# Altium schematic sheet onStep-board-uc.SchDoc
size A4
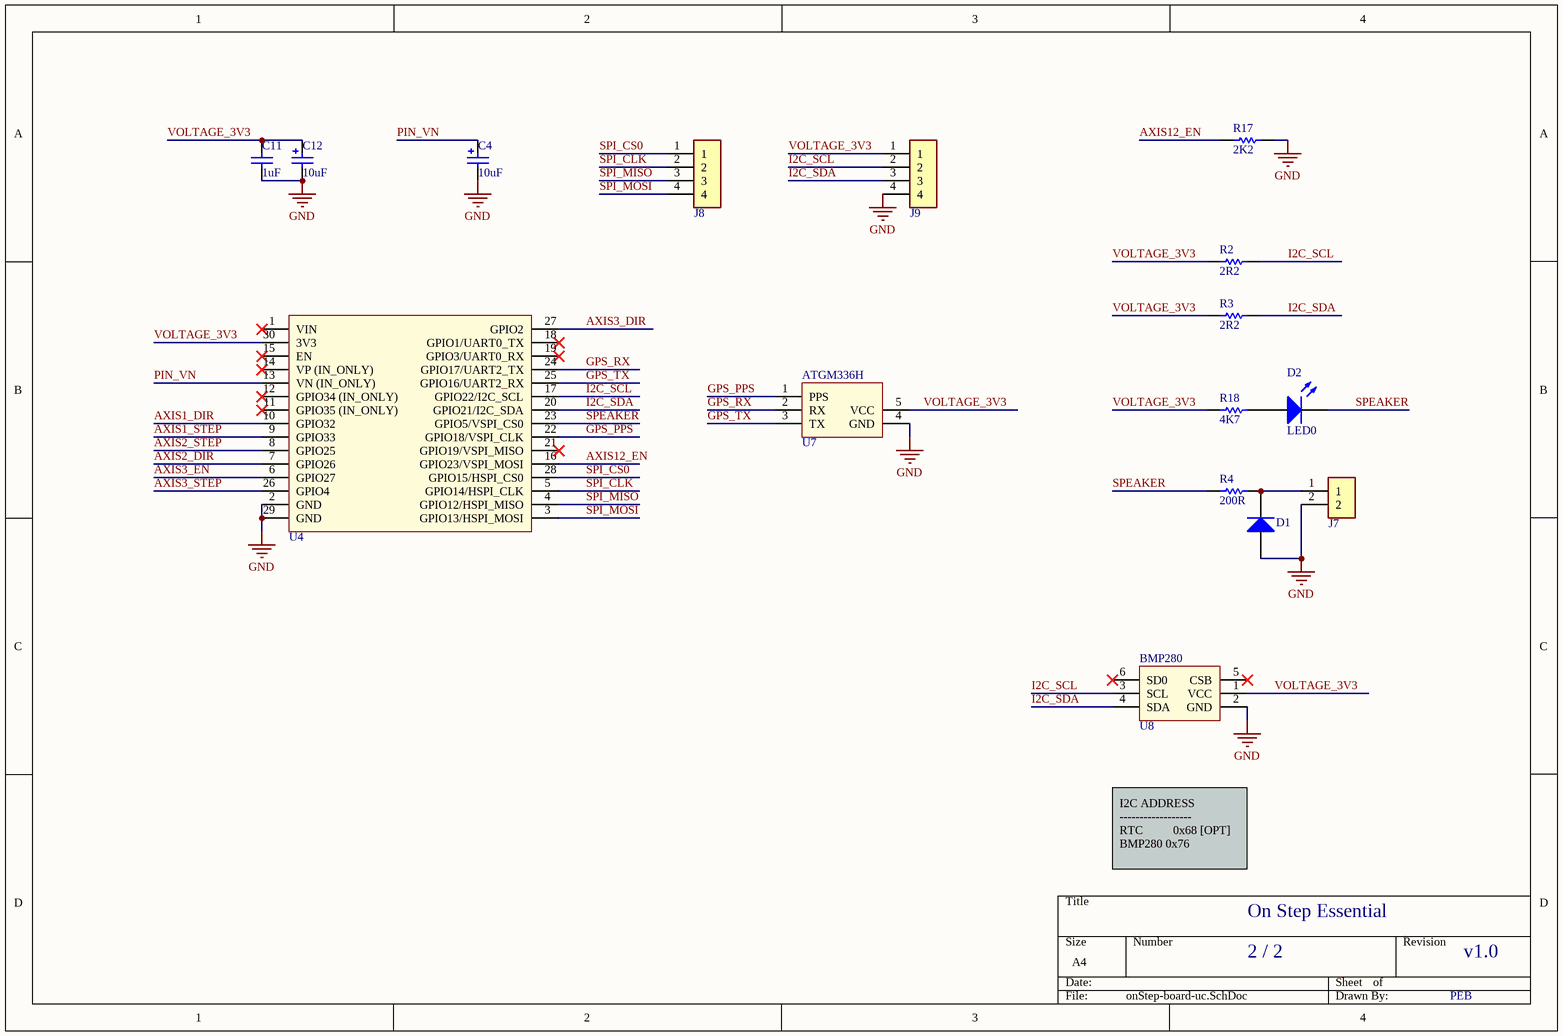
[diagram p0: onStep-board-uc.SchDoc]

## Parts
C4  value 10uF  [WCAP-ASLL_5x5.5]  (hidden comment: 865060453006)
C11  value 1uF  [0805]  (hidden comment: Cap)
C12  value 10uF  [WCAP-ASLL_5x5.5]  (hidden comment: 865060453006)
D1  Diode  [C1206]  (value not drawn)
D2  LED0  [LED-0]
J7  SPEAKER  [B2BXHALFSN]  (value not drawn)
J8  SPI  [p4]  (value not drawn)
J9  I2C  [p4]  (value not drawn)
R2  value 2R2  [0805]  (hidden comment: Res1)
R3  value 2R2  [0805]  (hidden comment: Res1)
R4  value 200R  [0805]  (hidden comment: Res1)
R17  value 2K2  [0805]  (hidden comment: Res1)
R18  value 4K7  [0805]  (hidden comment: Res1)
U4  ESP32-WROOM-DEVKIT  [ESP32-WROOM-DEVKIT]  (value not drawn)
U7  ATGM336H  [ATGM336H]
U8  BMP280  [BMP280]

## Nets
GND: C4.2(N) C11.1 C12.2(N) D1.1(A) J7.2 J9.4 R17.1 U4.2(GND) U4.29(GND) U7.4(GND) U8.2(GND)
AXIS1_DIR: U4.10(GPIO32)
AXIS1_STEP: U4.9(GPIO33)
AXIS2_DIR: U4.7(GPIO26)
AXIS2_STEP: U4.8(GPIO25)
AXIS3_DIR: U4.27(GPIO2)
AXIS3_EN: U4.6(GPIO27)
AXIS3_STEP: U4.26(GPIO4)
AXIS12_EN: R17.2 U4.16(GPIO23/VSPI_MOSI)
GPS_PPS: U4.22(GPIO18/VSPI_CLK) U7.1(PPS)
GPS_RX: U4.24(GPIO17/UART2_TX) U7.2(RX)
GPS_TX: U4.25(GPIO16/UART2_RX) U7.3(TX)
I2C_SCL: J9.2 R2.1 U4.17(GPIO22/I2C_SCL) U8.3(SCL)
I2C_SDA: J9.3 R3.1 U4.20(GPIO21/I2C_SDA) U8.4(SDA)
PIN_VN: C4.1(P) U4.13(VN_(IN_ONLY))
SPEAKER: D2.2(K) R4.2 U4.23(GPIO5/VSPI_CS0)
SPI_CLK: J8.2 U4.5(GPIO14/HSPI_CLK)
SPI_CS0: J8.1 U4.28(GPIO15/HSPI_CS0)
SPI_MISO: J8.3 U4.4(GPIO12/HSPI_MISO)
SPI_MOSI: J8.4 U4.3(GPIO13/HSPI_MOSI)
VOLTAGE_3V3: C11.2 C12.1(P) J9.1 R2.2 R3.2 R18.2 U4.30(3V3) U7.5(VCC) U8.1(VCC)
NetD1_2: D1.2(K) J7.1 R4.1
NetD2_1: D2.1(A) R18.1

Not connected (* = marked no-connect by the designer): U4 1(VIN)* 11(GPIO35_(IN_ONLY))* 12(GPIO34_(IN_ONLY))* 14(VP_(IN_ONLY))* 15(EN)* 18(GPIO1/UART0_TX)* 19(GPIO3/UART0_RX)* 21(GPIO19/VSPI_MISO)*; U8 5(CSB)* 6(SD0)*

## Notes on the sheet
- I2C ADDRESS
  ------------------
  RTC          0x68 [OPT]
  BMP280	0x76
- On Step Essential
- 2 / 2
- v1.0
- PEB

## Library data of the parts
C4 C12 = 865060453006: WCAP-ASLL Aluminum Electrolytic Capacitors, size Ф8x10.5mm, 25V DC, 150uF; Rated Voltage: 25V DC; ComponentLink1Description: Manufacturer; ComponentLink1URL: http://www.we-online.de; ComponentLink2Description: Datasheet; ComponentLink2URL: http://katalog.we-online.de/pbs/datasheet/865060453006.pdf; Part Number: 865060453006; Published Date: June 2017; Publisher: Wurth Elektronik; Size: Ф8x10.5mm; Life Cycle: 5000h; Operating Temperature: -55 °C up to +105 °C
C11 = Cap: Capacitor; Published: 8-Jun-2000; LatestRevisionDate: 17-Jul-2002; LatestRevisionNote: Re-released for DXP Platform.; PackageReference: RAD-0.3; Publisher: Altium Limited; PackageDescription: Radial Cap, Thru-Hole; 2 Leads; 0.3 in Pin Spacing
D1 = Diode: Default Diode; Published: 8-Jun-2000; LatestRevisionDate: 17-Jul-2002; LatestRevisionNote: Re-released for DXP Platform.; PackageVersion: Sep-1996; PackageReference: SMC; Publisher: Altium Limited; PackageDescription: DO-214-AB/SMC; 2 C-Bend Leads; Body 7.9 x 5.9 mm, inc. leads (LxW); Code_JEDEC: DO-214-AB
D2 = LED0: Typical INFRARED GaAs LED; Published: 8-Jun-2000; LatestRevisionDate: 08-Jul-2005; LatestRevisionNote: Mech Layer 1 removed.; PackageReference: LED-0; Publisher: Altium Limited; PackageDescription: LED; 2 Leads
J7 = B2B-XH-A_LF__SN_: Connector; Manufacturer_Name: JST (JAPAN SOLDERLESS TERMINALS); Manufacturer_Part_Number: B2B-XH-A(LF)(SN); Datasheet Link: http://www.jst-mfg.com/product/pdf/eng/eXH.pdf; Height: 7mm; Arrow Part Number: B2B-XH-A(LF)(SN); Arrow Price/Stock: https://www.arrow.com/en/products/b2b-xh-a-lf-sn/jst-manufacturing?region=europe
J8 J9 = B4B-XH-A_LF__SN_: Connector; Manufacturer_Name: JST (JAPAN SOLDERLESS TERMINALS); Manufacturer_Part_Number: B4B-XH-A(LF)(SN); Datasheet Link: https://datasheet.lcsc.com/szlcsc/JST-Sales-America-B4B-XH-A-LF-SN_C144395.pdf; Height: 7mm; Arrow Part Number: B4B-XH-A(LF)(SN); Arrow Price/Stock: https://www.arrow.com/en/products/b4b-xh-a-lf-sn/jst-manufacturing
R2-R4 R17 R18 = Res1: Resistor; Published: 8-Jun-2000; LatestRevisionDate: 17-Jul-2002; LatestRevisionNote: Re-released for DXP Platform.; PackageReference: AXIAL-0.3; Publisher: Altium Limited; PackageDescription: Axial Device, Thru-Hole; 2 Leads; 0.3 in Pin Spacing